# EAGLE design v5_Controller_PCB (EAGLE 7.2.0)
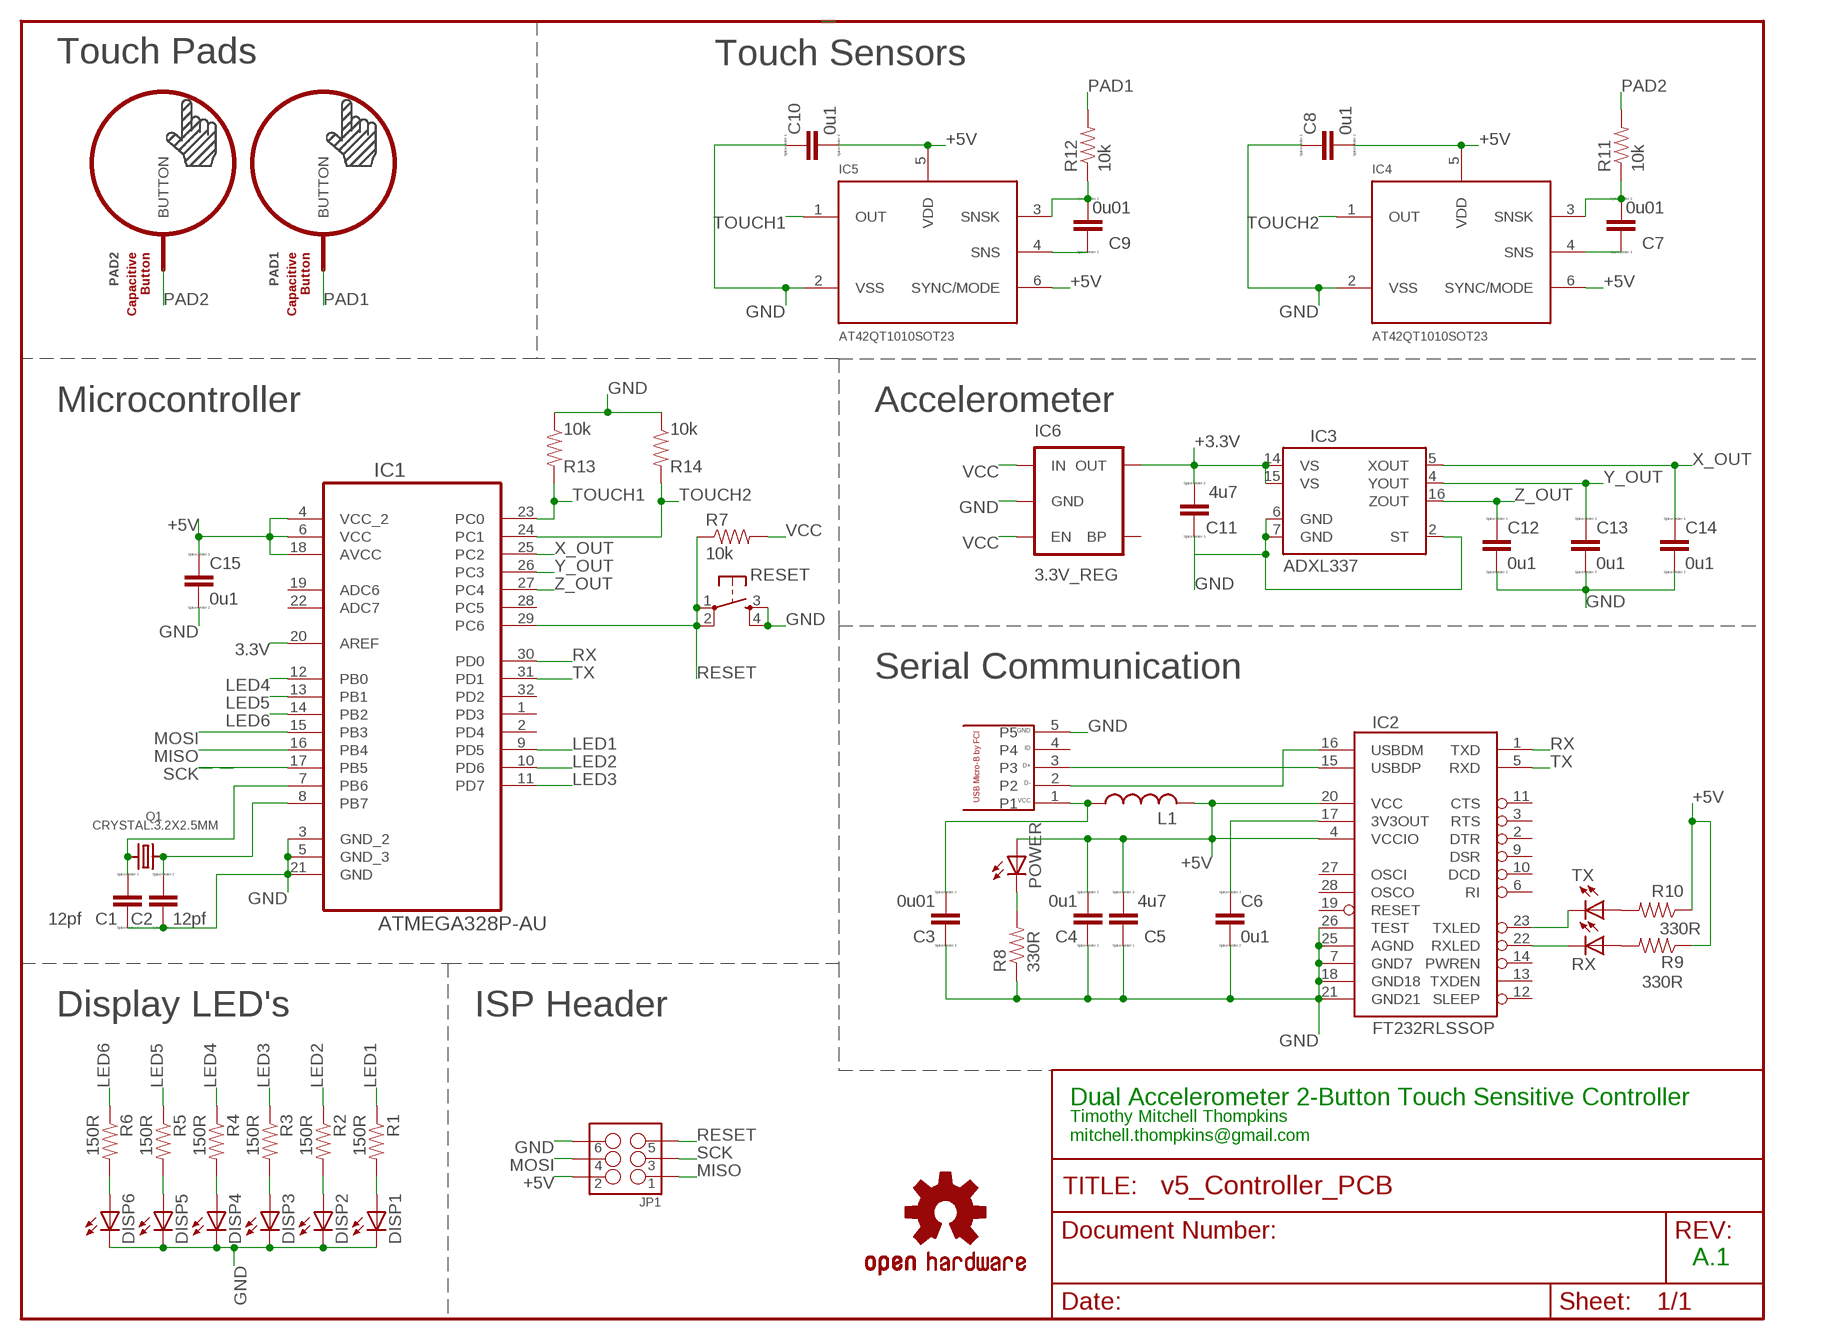
[diagram p0: schematic, sheet 1]

## Parts
BUTTON1  TOUCH_LOGO  [TOUCH_LOGO]
C1  12pf  CC0603  [C0603]
C2  12pf  CC0603  [C0603]
C3  0u01  CC0603  [C0603]
C4  0u1  CC0603  [C0603]
C5  4u7  CC0603  [C0603]
C6  0u1  CC0603  [C0603]
C7  0u01  CC0603  [C0603]
C8  0u1  CC0603  [C0603]
C9  0u01  CC0603  [C0603]
C10  0u1  CC0603  [C0603]
C11  4u7  CC0603  [C0603]
C12  0u1  CC0603  [C0603]
C13  0u1  CC0603  [C0603]
C14  0u1  CC0603  [C0603]
C15  0u1  CC0603  [C0603]
DISP1  LEDCHIPLED_0603  [CHIPLED_0603]
DISP2  LEDCHIPLED_0603  [CHIPLED_0603]
DISP3  LEDCHIPLED_0603  [CHIPLED_0603]
DISP4  LEDCHIPLED_0603  [CHIPLED_0603]
DISP5  LEDCHIPLED_0603  [CHIPLED_0603]
DISP6  LEDCHIPLED_0603  [CHIPLED_0603]
IC1  ATMEGA328P-AU  [QFP80P900X900X120-32N]
IC2  FT232RLSSOP  [SSOP28DB]
IC3  ADXL337  [LFCSP_LQ-16]
IC4  AT42QT1010SOT23  [SOT23-6]
IC5  AT42QT1010SOT23  [SOT23-6]
IC6  3.3V_REG  MIC52053.3V  [SOT23-5]
JP1  M03X2POGO_PINS  [2X3_POGO]
L1  L-USL2012C  [L2012C]
LOGO2  OSHW-LOGOS  [OSHW-LOGO-S]
PAD1  BUTTON_PASSIVE8MM  [BUTTON_PASSIVE_8MM]
PAD2  BUTTON_PASSIVE8MM  [BUTTON_PASSIVE_8MM]
POWER  LEDCHIPLED_0603  [CHIPLED_0603]
Q1  CRYSTAL.3.2X2.5MM  [3.2X2.5MM]
R1  150R  RESISTOR0603-RES  [0603-RES]
R2  150R  RESISTOR0603-RES  [0603-RES]
R3  150R  RESISTOR0603-RES  [0603-RES]
R4  150R  RESISTOR0603-RES  [0603-RES]
R5  150R  RESISTOR0603-RES  [0603-RES]
R6  150R  RESISTOR0603-RES  [0603-RES]
R7  10k  RESISTOR0603-RES  [0603-RES]
R8  330R  RESISTOR0603-RES  [0603-RES]
R9  330R  RESISTOR0603-RES  [0603-RES]
R10  330R  RESISTOR0603-RES  [0603-RES]
R11  10k  RESISTOR0603-RES  [0603-RES]
R12  10k  RESISTOR0603-RES  [0603-RES]
R13  10k  RESISTOR0603-RES  [0603-RES]
R14  10k  RESISTOR0603-RES  [0603-RES]
RESET  RESET  TAC_SWITCHSMD  [TACTILE_SWITCH_SMD]
RX  LEDCHIPLED_0603  [CHIPLED_0603]
TX  LEDCHIPLED_0603  [CHIPLED_0603]
U$1  USB_MICRO_B_FCI  [10118194-0001LF]
U$6  TOUCH_LOGO  [TOUCH_LOGO]

## Nets
3.3V: IC1.20(AREF)
+3.3V: C11.2 IC3.14(VS) IC3.15(VS) IC6.5(OUT)
+5V: C4.2 C5.2 C8.2 C10.2 C15.1 IC1.4(VCC_2) IC1.6(VCC) IC1.18(AVCC) IC2.4(VCCIO) IC2.20(VCC) IC4.5(VDD) IC4.6(SYNC/MODE) IC5.5(VDD) IC5.6(SYNC/MODE) JP1.P$2 L1.2 POWER.A R9.1 R10.1
GND: C1.1 C2.1 C3.1 C4.1 C5.1 C6.2 C8.1 C10.1 C11.1 C15.2 DISP1.C DISP2.C DISP3.C DISP4.C DISP5.C DISP6.C IC1.3(GND_2) IC1.5(GND_3) IC1.21(GND) IC2.7(GND7) IC2.18(GND18) IC2.21(GND21) IC2.25(AGND) IC2.26(TEST) IC3.2(ST) IC3.6(GND) IC3.7(GND) IC4.2(VSS) IC5.2(VSS) IC6.2(GND) JP1.P$6 R8.1 R13.1 R14.1 RESET.3 RESET.4 U$1.5
LED1: IC1.9(PD5) R1.1
LED2: IC1.10(PD6) R2.1
LED3: IC1.11(PD7) R3.1
LED4: IC1.12(PB0) R4.1
LED5: IC1.13(PB1) R5.1
LED6: IC1.14(PB2) R6.1
MISO: IC1.16(PB4) JP1.P$1
MOSI: IC1.15(PB3) JP1.P$4
N$1: C9.2 IC5.3(SNSK) R12.1
N$2: C3.2 L1.1 U$1.1
N$5: C2.2 IC1.8(PB7) Q1.3
N$6: C9.1 IC5.4(SNS)
N$7: POWER.C R8.2
N$8: C1.2 IC1.7(PB6) Q1.1
N$9: R10.2 TX.A
N$10: C6.1 IC2.17(3V3OUT)
N$11: R9.2 RX.A
N$12: IC2.16(USBDM) U$1.2
N$13: IC2.15(USBDP) U$1.3
N$14: IC2.23(TXLED) TX.C
N$15: IC2.22(RXLED) RX.C
N$16: C12.2 C13.2 C14.2
N$19: C7.1 IC4.4(SNS)
N$22: C7.2 IC4.3(SNSK) R11.1
N$24: DISP1.A R1.2
N$25: DISP2.A R2.2
N$26: DISP3.A R3.2
N$27: DISP4.A R4.2
N$28: DISP5.A R5.2
N$29: DISP6.A R6.2
PAD1: PAD1.P$1(BUTTON) R12.2
PAD2: PAD2.P$1(BUTTON) R11.2
RESET: IC1.29(PC6) JP1.P$5 R7.1 RESET.1 RESET.2
RX: IC1.30(PD0) IC2.1(TXD)
SCK: IC1.17(PB5) JP1.P$3
TOUCH1: IC1.23(PC0) IC5.1(OUT) R13.2
TOUCH2: IC1.24(PC1) IC4.1(OUT) R14.2
TX: IC1.31(PD1) IC2.5(RXD)
VCC: IC6.1(IN) IC6.3(EN) R7.2
X_OUT: C14.1 IC1.25(PC2) IC3.5(XOUT)
Y_OUT: C13.1 IC1.26(PC3) IC3.4(YOUT)
Z_OUT: C12.1 IC1.27(PC4) IC3.16(ZOUT)
Unconnected: IC1.1(PD3) IC1.2(PD4) IC1.19(ADC6) IC1.22(ADC7) IC1.28(PC5) IC1.32(PD2) IC2.2(DTR) IC2.3(RTS) IC2.6(RI) IC2.9(DSR) IC2.10(DCD) IC2.11(CTS) IC2.12(SLEEP) IC2.13(TXDEN) IC2.14(PWREN) IC2.19(RESET) IC2.27(OSCI) IC2.28(OSCO) IC6.4(BP) U$1.4

## Notes on the sheet
- Touch Pads | Touch Sensors
- Microcontroller | Accelerometer
- Serial Communication
- Display LED's | ISP Header
- Dual Accelerometer 2-Button Touch Sensitive Controller
- Timothy Mitchell Thompkins
  mitchell.thompkins@gmail.com
- A.1

## Power pins joined to a net without a drawn wire
GND: Q1.2(GND) Q1.4(GND) U$1.GND@1(GND) U$1.GND@2(GND) U$1.GND@3(GND) U$1.GND@4(GND)

## Library data of the parts
BUTTON1 U$6 = Touch_Logo:TOUCH_LOGO
C1-C15 = eagle-ltspice:C: CAPACITOR, European symbol; SPICEMODEL: NONE; SPICEPREFIX: C
DISP1-DISP6 POWER RX TX = adafruit:LED: LED OSRAM: - CHIPLED LG R971, LG N971, LY N971, LG Q971, LY Q971, LO R971, LY R971 LH N974, LH R974 LS Q976, LO Q976, LY Q976 LO Q996 - Hyper CHIPLED LW Q18S LB Q993, LB Q99A, LB R99A - SideLED LS A670, LO A670, LY A670, LG A670, LP A670 LB A673, LV A673, LT A673, LW A673 LH A674 LY A675 LS A676, LA A676, LO A676, LY A676, LW A676 LS A679, LY A679, LG A679 - Hyper Micro SIDELED® LS Y876, LA Y876, LO Y876, LY Y876 LT Y87S - SmartLED LW L88C, LW L88S LB L89C, LB L89S, LG L890 LS L89K, LO L89K, LY L89K LS L896, LA L896, LO L896, LY L896 - TOPLED LS T670, LO T670, LY T670, LG T670, LP T670 LSG T670, LSP T670, LSY T670, LOP T670, LYG T670 LG T671, LOG T671, LSG T671 LB T673, LV T673, LT T673, LW T673 LH T674 LS T676, LA T676, LO T676, LY T676, LB T676, LH T676, LSB T676, LW T676 LB T67C, LV T67C, LT T67C, LS T67K, LO T67K, LY T67K, LW E67C LS E67B, LA E67B, LO E67B, LY E67B, LB E67C, LV E67C, LT E67C LW T67C LS T679, LY T679, LG T679 LS T770, LO T770, LY T770, LG T770, LP T770 LB T773, LV T773, LT T773, LW T773 LH T774 LS E675, LA E675, LY E675, LS T675 LS T776, LA T776, LO T776, LY T776, LB T776 LHGB T686 LT T68C, LB T68C - Hyper Mini TOPLED® LB M676 - Mini TOPLED Santana® LG M470 LS M47K, LO M47K, LY M47K Source: http://www.osram.convergy.de/
IC1 = Atmel_By_element14_Batch_1-00:ATMEGA328P-AU: 8-bit Microcontroller with In-System Programmable Flash; MPN: ATMEGA328P-AU; OC_FARNELL: 1715486; OC_NEWARK: 14R4631; PACKAGE: TQFP-32; SUPPLIER: Atmel
IC2 = SparkFun:FT232RL: USB UART FT232RL 4th Generation USB UART (USB <-> Serial) Controller. Spark Fun Electronics SKU : COM-00650
IC3 = SparkFun-Sensors:ADXL337: ADXL337 Low Power 3-Axis ±3 g Accelerometer with Analog Output.
IC4 IC5 = SparkFun-DigitalIC:AT42QT1010
IC6 = SparkFun-PowerIC:MIC5205: MIC5205 150mA vreg 3.3V - VREG-00822 5V - VREG-00823; PROD_ID: VREG-00822
JP1 = SparkFun-Connectors:M03X2: 2x3 .1" header. Shrouded, with keying- CONN-10681 SMT- CONN-11415 Pogo pins- HW-11044; PROD_ID: HW-11044
L1 = rcl:L-US: INDUCTOR, American symbol
LOGO2 = SparkFun-Aesthetics:OSHW-LOGO: Open Source Hardware Logo This logo indicates the piece of hardware it is found on incorporates a OSHW license and/or adheres to the definition of open source hardware found here: http://freedomdefined.org/OSHW
PAD1 PAD2 = PatternAgents-TouchWidgets:BUTTON_PASSIVE: Button, Passive Capacitive/Touch Sensing Type Source : http://www.PatternAgents.com Github : https://github.com/PatternAgents License : http://creativecommons.org/licenses/by-sa/3.1/ (Creative Commons 3.1) THIS SOFTWARE IS PROVIDED BY THE CONTRIBUTORS "AS IS" AND WITHOUT ANY EXPRESS OR IMPLIED WARRANTIES, INCLUDING, BUT NOT LIMITED TO, THE IMPLIED WARRANTIES OF MERCHANTABILITY AND FITNESS FOR A PARTICULAR PURPOSE ARE DISCLAIMED. IN NO EVENT SHALL THE COPYRIGHT OWNER OR CONTRIBUTORS BE LIABLE FOR ANY DIRECT, INDIRECT, INCIDENTAL, SPECIAL, EXEMPLARY, OR CONSEQUENTIAL DAMAGES (INCLUDING, BUT NOT LIMITED TO, PROCUREMENT OF SUBSTITUTE GOODS OR SERVICES; LOSS OF USE, DATA, OR PROFITS; OR BUSINESS INTERRUPTION) HOWEVER CAUSED AND ON ANY THEORY OF LIABILITY, WHETHER IN CONTRACT, STRICT LIABILITY, OR TORT (INCLUDING NEGLIGENCE OR OTHERWISE) ARISING IN ANY WAY OUT OF THE USE OF THIS SOFTWARE, EVEN IF ADVISED OF THE POSSIBILITY OF SUCH DAMAGE.
Q1 = abracon:CRYSTAL
R1-R14 = SparkFun:RESISTOR: Resistor Basic schematic elements and footprints for 0603, 1206, and PTH resistors.
RESET = SparkFun:TAC_SWITCH: Momentary Switch Button commonly used for reset or general input. Spark Fun Electronics SKU : COM-00097
U$1 = MicroUSB_B_10118194_0001LF:USB_MICRO_B_FCI

## Net classes
0 default: clearance 0.205 mm

## Board
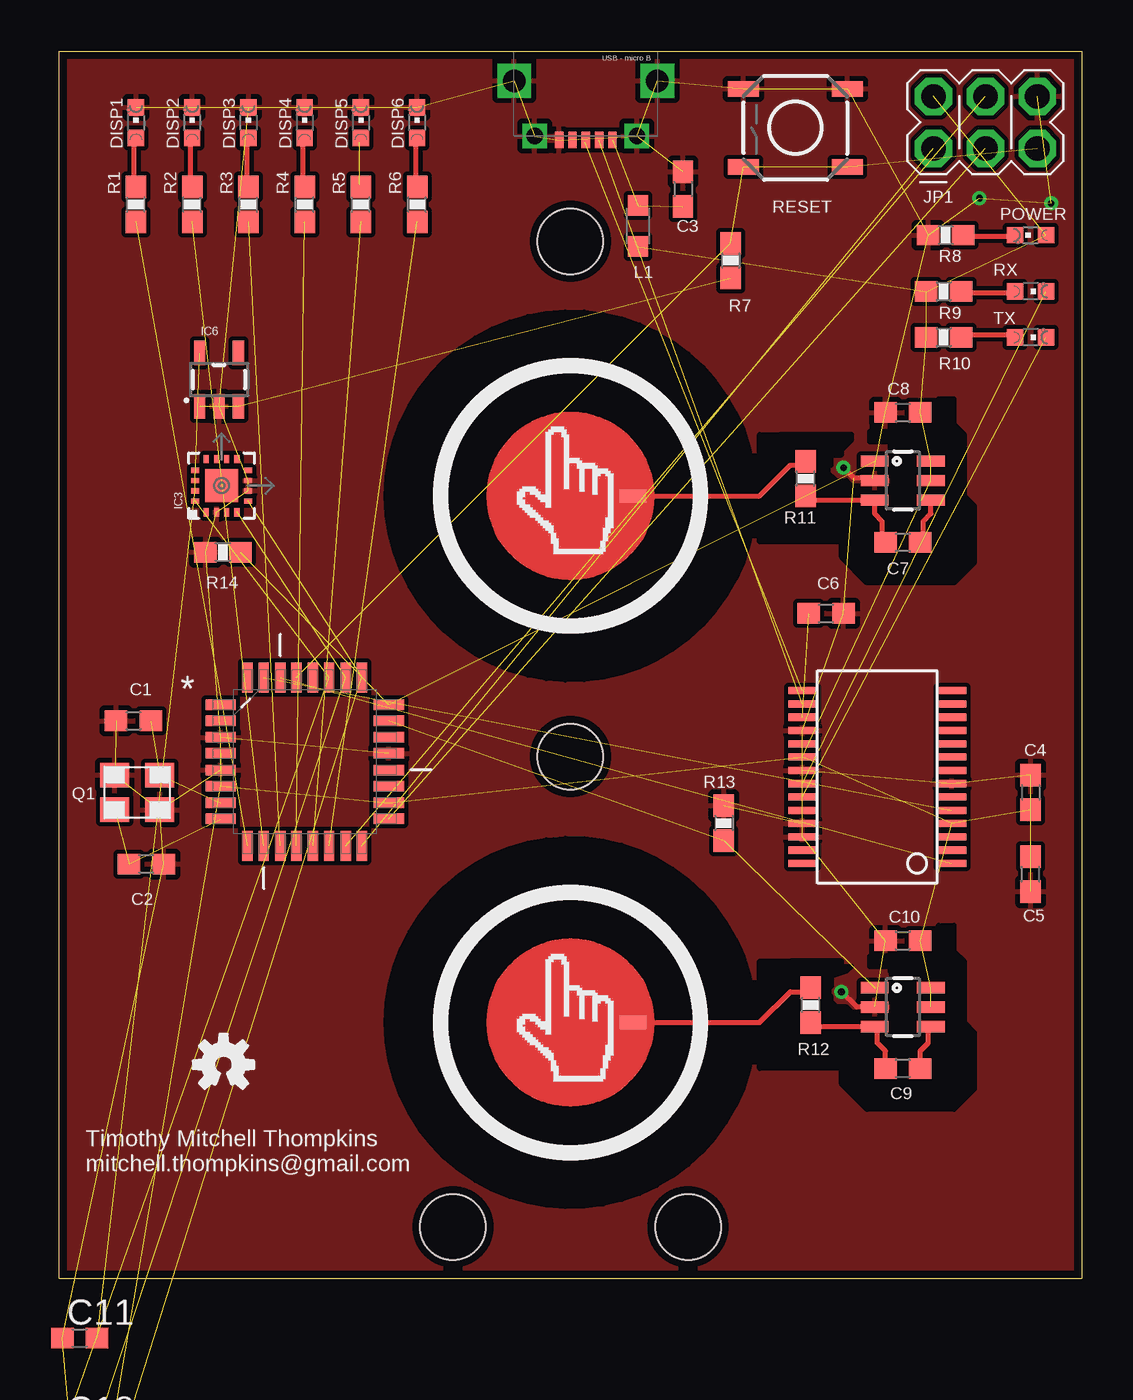
[diagram p1: board, top side]
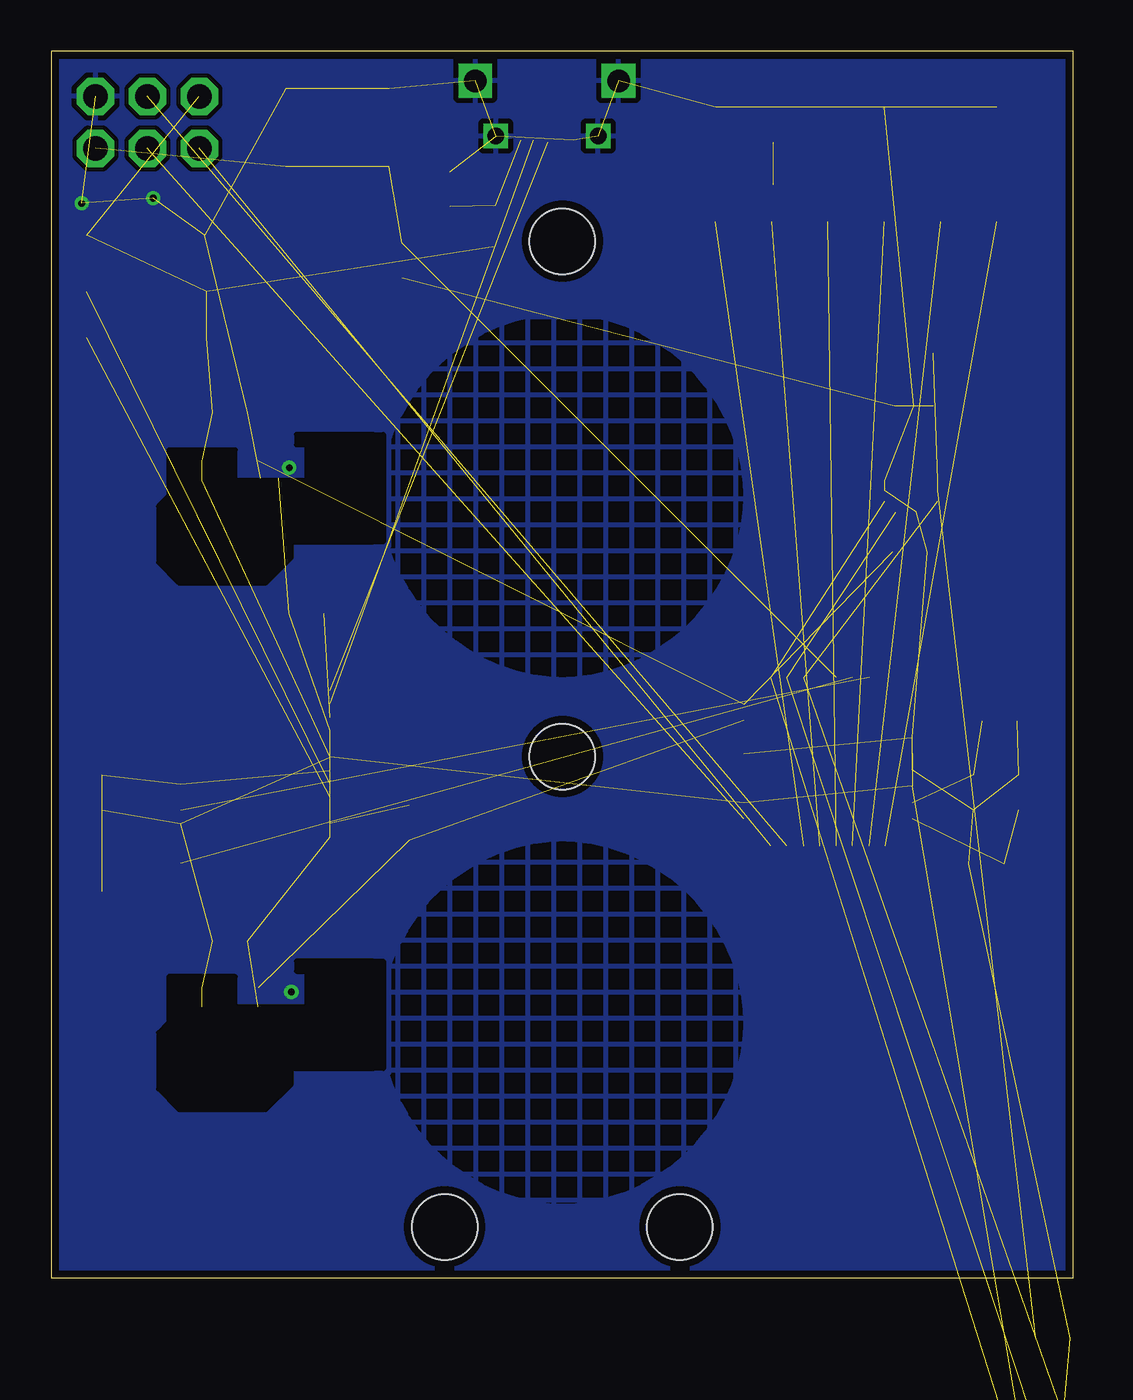
[diagram p2: board, bottom side, seen from below]

Size 50 x 60 mm. Coordinates in mm from the lower left corner, seen from the top.
Outline: 0,0 0,60 50,60 50,0 0,0
Copper layers (1*16): Top 0.0356mm / dielectric 1.5011mm / Bottom 0.0356mm
Design rules "oshpark *": minimum track width 10mil, minimum drill 13mil, track to track 8mil, track to pad 8mil, pad to pad 8mil, via to via 8mil, smd to smd 8mil, copper to edge 15mil, drill to drill 15mil, minimum pad ring 7mil, minimum via ring 7mil, stop-mask expansion 3mil, vias tented up to drill 0mil, thermal gap 10mil
Holes 3.2 mm at 19.25,2.5 30.75,2.5 25,50.7 25,25.5
tRestrict: area 34.2,13 to 35.5,15.5; area 40.5,11 to 42,14.5; area 42.8,12.8 to 44.2,17.2; area 35.8,14.5 to 38.2,15.5; area 37.5,12.8 to 39,13.5; area 40.5,36.8 to 42,40.2; area 42.8,38.5 to 44.2,43; area 39.6,40.4 to 42.2,41.4; area 39.6,14.7 to 42.2,15.7; area 34.2,8.2 to 44.8,12.5; area 37.5,14.2 to 38.8,15.2; area 37.5,13.8 to 37.8,14; area 34.2,34 to 44.8,38.2; area 34.2,38.8 to 35.5,41.2; area 35.5,40.2 to 38,41.2; area 37.5,14.2 to 38.8,15.2; area 37.2,38.5 to 39,39.5; area 37.2,39.8 to 38.8,41.2; area 34.8,12 to 36,13.5; area 34.5,37.8 to 35.8,39.2; 2 lines
bRestrict: area 34.2,8.2 to 44.8,15.5; area 34.2,34 to 44.8,41.2; area 33.8,36 to 35.5,41.2; area 33.8,10.2 to 35.5,15.5
vRestrict: area 16,29.2 to 34,47.2; area 16,3.5 to 34,21.5

### Footprints (pad centres in the part's own frame; a part is rotated, then mirrored left to right if it is on the bottom)
C0603 = smd 1.1 x 1: 1 -0.85,0; 2 0.85,0
CHIPLED_0603 = smd 0.8 x 0.8: A 0,-0.75; C 0,0.75
QFP80P900X900X120-32N = smd 1.473 x 0.508: 1 -4.115,2.794; 2 -4.115,2.007; 3 -4.115,1.194; 4 -4.115,0.406; 5 -4.115,-0.406; 6 -4.115,-1.194; 7 -4.115,-2.007; 8 -4.115,-2.794; 17 4.115,-2.794; 18 4.115,-2.007; 19 4.115,-1.194; 20 4.115,-0.406; 21 4.115,0.406; 22 4.115,1.194; 23 4.115,2.007; 24 4.115,2.794 | smd 0.508 x 1.473: 9 -2.794,-4.115; 10 -2.007,-4.115; 11 -1.194,-4.115; 12 -0.406,-4.115; 13 0.406,-4.115; 14 1.194,-4.115; 15 2.007,-4.115; 16 2.794,-4.115; 25 2.794,4.115; 26 2.007,4.115; 27 1.194,4.115; 28 0.406,4.115; 29 -0.406,4.115; 30 -1.194,4.115; 31 -2.007,4.115; 32 -2.794,4.115
SSOP28DB = smd 0.348 x 1.397: 1 -4.225,-3.656; 2 -3.575,-3.656; 3 -2.925,-3.656; 4 -2.275,-3.656; 5 -1.625,-3.656; 6 -0.975,-3.656; 7 -0.325,-3.656; 8 0.325,-3.656; 9 0.975,-3.656; 10 1.625,-3.656; 11 2.275,-3.656; 12 2.925,-3.656; 13 3.575,-3.656; 14 4.225,-3.656; 15 4.225,3.656; 16 3.575,3.656; 17 2.925,3.656; 18 2.275,3.656; 19 1.625,3.656; 20 0.975,3.656; 21 0.325,3.656; 22 -0.325,3.656; 23 -0.975,3.656; 24 -1.625,3.656; 25 -2.275,3.656; 26 -2.925,3.656; 27 -3.575,3.656; 28 -4.225,3.656
LFCSP_LQ-16 = smd 0.4 x 0.25: 1 -1.3,0.75; 2 -1.3,0.25; 3 -1.3,-0.25; 4 -1.3,-0.75; 9 1.3,-0.75; 10 1.3,-0.25; 11 1.3,0.25; 12 1.3,0.75 | smd 0.25 x 0.4: 5 -0.75,-1.3; 6 -0.25,-1.3; 7 0.25,-1.3; 8 0.75,-1.3; 13 0.75,1.3; 14 0.25,1.3; 15 -0.25,1.3; 16 -0.75,1.3 | smd 1.6 x 1.6: EXP 0,0
SOT23-6 = smd 0.55 x 1.35: 1 -0.95,-1.375; 2 0,-1.375; 3 0.95,-1.375; 4 0.95,1.375; 5 0,1.375; 6 -0.95,1.375
SOT23-5 = smd 0.55 x 1.2: 1 -0.95,-1.3; 2 0,-1.3; 3 0.95,-1.3; 4 0.95,1.3; 5 -0.95,1.3
2X3_POGO = drill 1.2 pad 1.829 octagon: P$1 0,0; P$2 0,2.54; P$3 2.54,0; P$4 2.54,2.54; P$5 5.08,0; P$6 5.08,2.54
L2012C = smd 1 x 1: 1 -1,0; 2 1,0
BUTTON_PASSIVE_8MM = smd 0.635 x 1.27: P$1 0,3.048
3.2X2.5MM = smd 1.4 x 1.2: 1 -1.1,-0.85; 2 1.1,-0.85; 3 1.1,0.85; 4 -1.1,0.85
0603-RES = smd 1.1 x 1: 1 -0.85,0; 2 0.85,0
TACTILE_SWITCH_SMD = smd 1.524 x 0.762: 1 -2.54,1.905; 2 2.54,1.905; 3 -2.54,-1.905; 4 2.54,-1.905
10118194-0001LF = smd 0.406 x 0.813: 1 -1.3,2.7; 2 -0.65,2.7; 3 0,2.7; 4 0.65,2.7; 5 1.3,2.7 | drill 1.1 pad 1.422 square: GND@1 -3.5,-0.2; GND@4 3.5,-0.2 | drill 0.8 pad 1.016 square: GND@2 -2.5,2.5; GND@3 2.5,2.5

### Placement (x,y rotation side)
BUTTON1  25.25,37.5 0 top
C1  3.63,27.25 0 top
C2  4.26,20.25 180 top
C3  30.5,53.25 270 top
C4  47.5,23.75 270 top
C5  47.5,19.75 90 top
C6  37.5,32.5 0 top
C7  41.25,35.98 180 top
C8  41.25,42.32 0 top
C9  41.25,10.25 180 top
C10  41.25,16.5 0 top
C11  1,-2.94 0 top
C12  1,-7.69 0 top  (outside the outline)
C13  1,-12.44 0 top  (outside the outline)
C14  1,-17.19 0 top  (outside the outline)
C15  1,-21.94 0 top  (outside the outline)
DISP1  3.75,56.5 0 top
DISP2  6.5,56.5 0 top
DISP3  9.25,56.5 0 top
DISP4  12,56.5 0 top
DISP5  14.75,56.5 0 top
DISP6  17.5,56.5 0 top
IC1  12,25.25 0 top
IC2  40,24.5 90 top
IC3  7.94,38.75 90 top
IC4  41.25,39 270 top
IC5  41.25,13.25 270 top
IC6  7.81,43.94 0 top
JP1  42.75,55.25 0 top
L1  28.3,51.45 270 top
LOGO2  8.03,10.44 0 top
PAD1  25,12.5 270 top
PAD2  25,38.25 270 top
POWER  47.5,51 90 top
Q1  3.81,23.75 180 top
R1  3.75,52.5 90 top
R2  6.5,52.5 90 top
R3  9.25,52.5 90 top
R4  12,52.5 90 top
R5  14.75,52.5 90 top
R6  17.5,52.5 90 top
R7  32.83,49.76 270 top
R8  43.35,51 0 top
R9  43.25,48.25 0 top
R10  43.25,46 0 top
R11  36.5,39.1 90 top
R12  36.75,13.35 90 top
R13  32.5,22.25 270 top
R14  8,35.5 0 top
RESET  36,56.25 180 top
RX  47.5,48.25 270 top
TX  47.5,46 270 top
U$1  25.75,58.35 180 top
U$6  25.25,11.72 0 top

### Tracks (layer width: path | path; a pad name or v marks a point on that pad's centre or on a via)
+3.3V  (3 unrouted)
+5V  (18 unrouted)
GND  (via drill 0.33, 0.33 pad 0.25)  (44 unrouted)
  Top 0.254: IC5.2 39,13.25 v38.25,14 | IC4.2 39.76,39.12 38.86,39.12 v38.35,39.62
  other vias: 45,52.81 48.5,52.56
  pour Bottom (hatched): 16,12.5 arc-90 25,21.5 arc-90 34,12.5 arc-90 25,3.5 arc-90
  pour Bottom: 0,0 50,0 50,12.5 34,12.5 arc-90 25,3.5 arc-90 16,12.5 0,12.5
  pour Bottom (hatched): 16,38.25 arc-90 25,47.25 arc-90 34,38.25 arc-90 25,29.25 arc-90
  pour Bottom: 0,12.5 16,12.5 arc-90 25,21.5 arc-90 34,12.5 50,12.5 50,38.25 34,38.25 arc-90 25,29.25 arc-90 16,38.25 0,38.25
  pour Bottom: 0,38.25 16,38.25 arc-90 25,47.25 arc-90 34,38.25 50,38.25 50,60 0,60
  pour Top: 0,0 50,0 50,60 0,60
LED1  (1 unrouted)
LED2  (1 unrouted)
LED3  (1 unrouted)
LED4  (1 unrouted)
LED5  (1 unrouted)
LED6  (1 unrouted)
MISO  (1 unrouted)
MOSI  (1 unrouted)
N$1
  Top 0.254: R12.1 36.95,12.3 IC5.3 40,12.18 40,11.5 40.4,11.1 C9.2
N$2  (2 unrouted)
N$5  (2 unrouted)
N$6
  Top 0.254: C9.1 42.1,11.1 42.5,11.5 42.5,12.18 IC5.4
N$7
  Top 0.254: POWER.C 46.59,50.95 44.29,50.95 R8.2
N$8  (2 unrouted)
N$9
  Top 0.254: TX.A 46.59,46.13 44.29,46.13 R10.2
N$10  (1 unrouted)
N$11
  Top 0.254: RX.A 46.59,48.2 44.29,48.2 R9.2
N$12  (1 unrouted)
N$13  (1 unrouted)
  Top 0.254: 25.7,55.54 U$1.3
N$14  (1 unrouted)
N$15  (1 unrouted)
N$16  (2 unrouted)
N$19
  Top 0.254: C7.1 42.25,36.13 42.25,37 42.62,37.38 IC4.4
N$22
  Top 0.254: R11.1 36.7,38.05 IC4.3 39.88,37.38 40.25,37 40.25,36.13 C7.2
N$24
  Top 0.254: DISP1.A 3.67,55.54 3.67,53.47 R1.2
N$25
  Top 0.254: DISP2.A 6.43,55.54 6.43,53.47 R2.2
N$26
  Top 0.254: DISP3.A 9.18,55.54 9.18,53.47 R3.2
N$27
  Top 0.254: DISP4.A 11.93,55.54 11.93,53.47 R4.2
N$28  (1 unrouted)
  Top 0.254: 14.69,55.54 DISP5.A | 14.69,53.47 R5.2
N$29
  Top 0.254: DISP6.A 17.44,55.54 17.44,53.47 R6.2
PAD1
  Top 0.254: PAD1.P$1 34.25,12.5 35.75,14 36.55,14 R12.2
PAD2
  Top 0.254: PAD2.P$1 34.25,38.25 35.75,39.75 36.3,39.75 R11.2
RESET  (4 unrouted)
RX  (1 unrouted)
SCK  (1 unrouted)
TOUCH1  (2 unrouted)
TOUCH2  (2 unrouted)
TX  (1 unrouted)
VCC  (2 unrouted)
X_OUT  (2 unrouted)
  Top 0.254: IC1.25 14.75,29.44
Y_OUT  (2 unrouted)
Z_OUT  (2 unrouted)

### Text on the board
tPlace: Timothy Mitchell Thompkins / mitchell.thompkins@gmail.com | /Users/TimothyThompkins/Projects/Interactive Game/Eagle_Files/Controller PCB/v2_Controller_PCB/Touch_Logo.bmp